# Altium schematic sheet Power supply.SchDoc: Motor Vibration
size A4; Organization: NTUST EE-305; Address1: No.43, Sec. 4, Keelung Rd.; Address2: Da’an Dist.; Address3: Taipei 106; Address4: Taiwan (R.O.C.); DocumentNumber: 1; Revision: 3.0; SheetNumber: 4; SheetTotal: 9
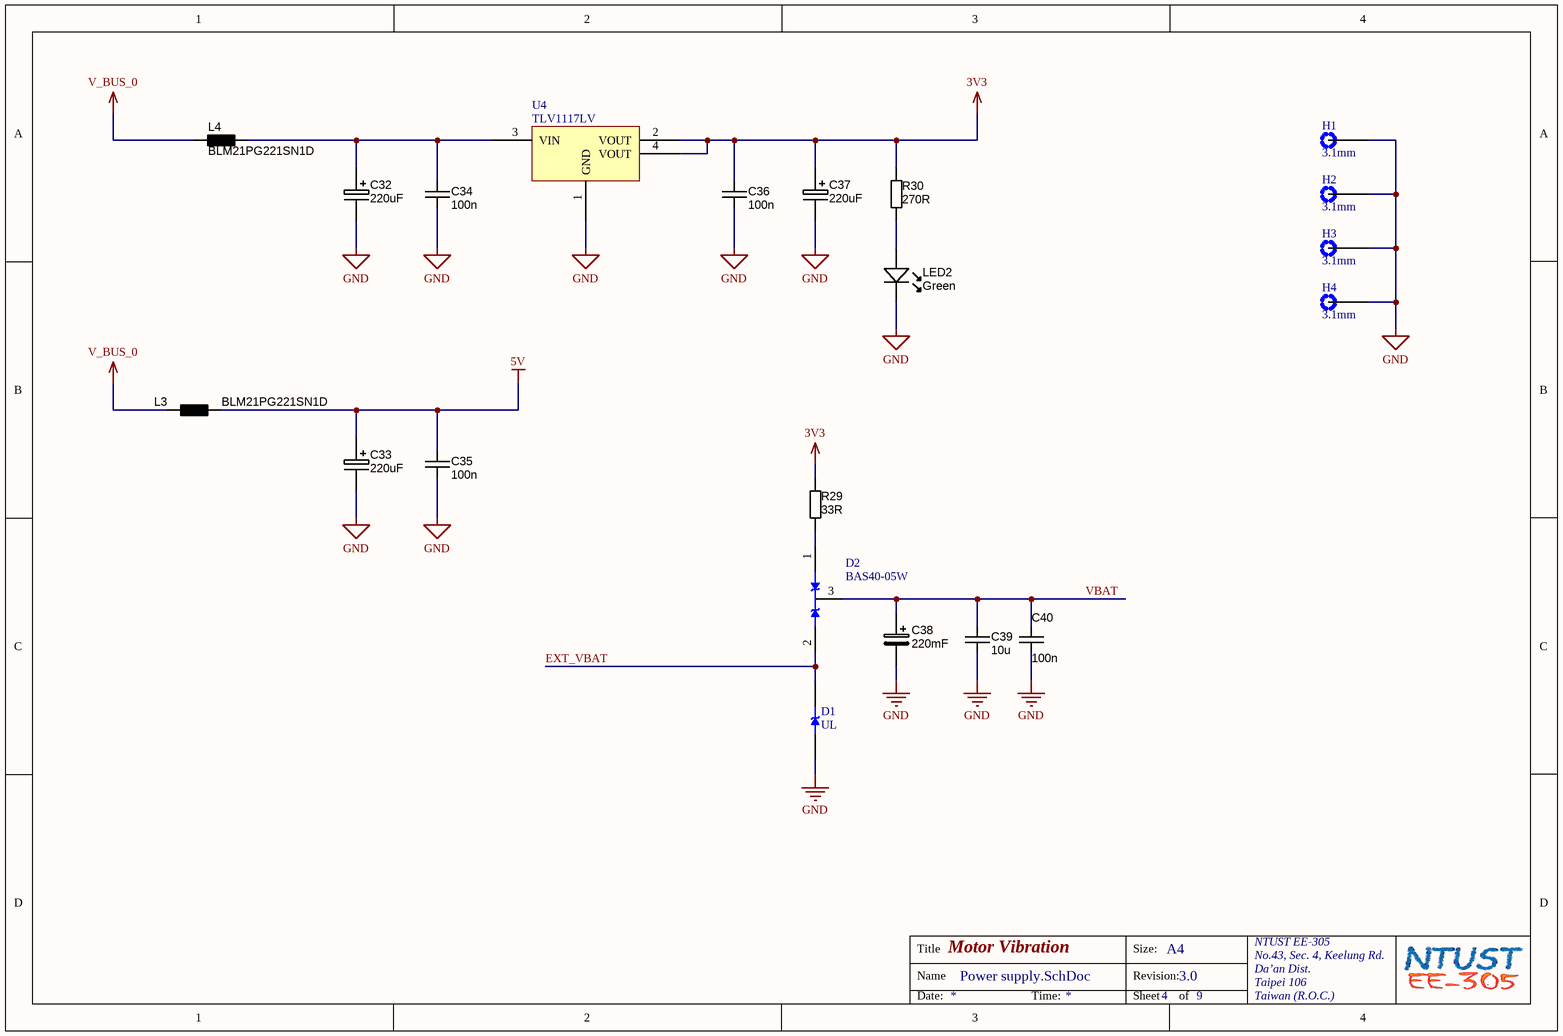
[diagram p0: Power supply.SchDoc]

## Parts
C32  220uF  [CAP_ELEC_SIZE_D8]
C33  220uF  [CAP_ELEC_SIZE_D8]
C34  100n  [CAPC1005N]
C35  100n  [CAPC1005N]
C36  100n  [CAPC1005N]
C37  220uF  [CAP_ELEC_SIZE_D8]
C38  220mF  [CAPC3225N]
C39  10u  [CAPC1005N]
C40  100n  [CAPC1005N]
D1  UL  [SOD323]
D2  BAS40-05W  [SOT323(SC70)]
H1  3.1mm  [Holes]
H2  3.1mm  [Holes]
H3  3.1mm  [Holes]
H4  3.1mm  [Holes]
L3  BLM21PG221SN1D  [INDC2012N]
L4  BLM21PG221SN1D  [INDC2012N]
LED2  Green  [LED-0603-GREEN]
R29  33R  [RESC1005N]
R30  270R  [RESC1005N]
U4  TLV1117LV  [SOT-223-DB3_N]

## Nets
3V3: C36.1 C37.1 R29.1 R30.1 U4.2(VOUT) U4.4(VOUT)
5V: C33.1 C35.1 L3.2
GND: C32.2 C33.2 C34.2 C35.2 C36.2 C37.2 C38.2 C39.2 C40.2 D1.2(anode) H1.0 H2.0 H3.0 H4.0 LED2.K U4.1(GND)
V_BUS_0: L3.1 L4.1
EXT_VBAT: D1.1(cathode) D2.2
VBAT: C38.1 C39.1 C40.1 D2.3
NetC32_1: C32.1 C34.1 L4.2 U4.3(VIN)
NetD2_1: D2.1 R29.2
NetLED2_A: LED2.A R30.2

## Notes on the sheet
- Title
- Name
- Size:
- Revision:
- A4
- Date:
- Time:
- Sheet
- of

## Library data of the parts
C32 C33 C37 = Capacitor SMD Alum Elec: Ratings: 10V; 105蚓; Tolerance: ?0%; Material: Al; Package / Case: Radial - Surface Mount; Supplier 1: Digi-Key; Supplier Part Number 1: PCE4185CT-ND; Value: 220uF
C34-C36 C40 = Capacitor SMD Cer X7R: Manufacturer 1: Kemet; Manufacturer Part Number 1: C0805C104K5RACTU; Tolerance: ?0%; Ratings: 50V; X7R; Material: ceramic; Package / Case: 0805 (2012 metric); Supplier 1: Digi-Key; Supplier Part Number 1: 399-1170-1-ND; Value: 100n
C38 = DSK-3R3H224U-HL: CAP 220MF -20% +80% 3.3V SMD; Supplier 1: Digi-Key; Supplier Part Number 1: 604-1020-1-ND; Value: 220mF
C39 = Capacitor SMD Cer X5R: Manufacturer 1: Kemet; Manufacturer Part Number 1: C0805C104K5RACTU; Tolerance: ?0%; Ratings: 50V; X7R; Material: ceramic; Package / Case: 0805 (2012 metric); Supplier 1: Digi-Key; Supplier Part Number 1: 399-1170-1-ND; Value: 10u
D1 = PMEG4005EJ: DIODE SCHOTTKY 40V 500MA SOD323F; Supplier 1: Digi-Key; Supplier Part Number 1: 568-4133-1-ND
D2 = BAS40 series: General-purpose Schottky diodes
H1-H4 = Holes: Mounting Holes
L3 L4 = BLM21PG221SN1D: EMIFILr (Inductor type) Chip Ferrite Bead; Supplier 1: Digi-Key; Supplier Part Number 1: 490-1054-1-ND
LED2 = LED_SMD_Green_0805_8mcd: LED, 0805 SMD, Green; Manufacturer 1: Ligitek; Manufacturer Part Number 1: LG-170PG-CT; Material: GaP; Ratings: 8 mcd; 558 nm; Package / Case: 0805
R29 R30 = Resistor SMD chip: Manufacturer 1: Yageo; Manufacturer Part Number 1: RC0805JR-0710KL; Ratings: 1/8 W; Tolerance: ?%; Package / Case: 0805 (2012 metric); Material: Thick Film; Supplier 1: Digi-Key; Supplier Part Number 1: 311-10KARCT-ND
  R29: Value: 33R
  R30: Value: 270R
U4 = TLV1117LV: 1-A, Positive Fixed-Voltage, Low-Dropout Regulator; Supplier 1: Digi-Key; Supplier Part Number 1: 296-28778-1-ND